# EAGLE design circle_9axis (EAGLE 7.4.0)
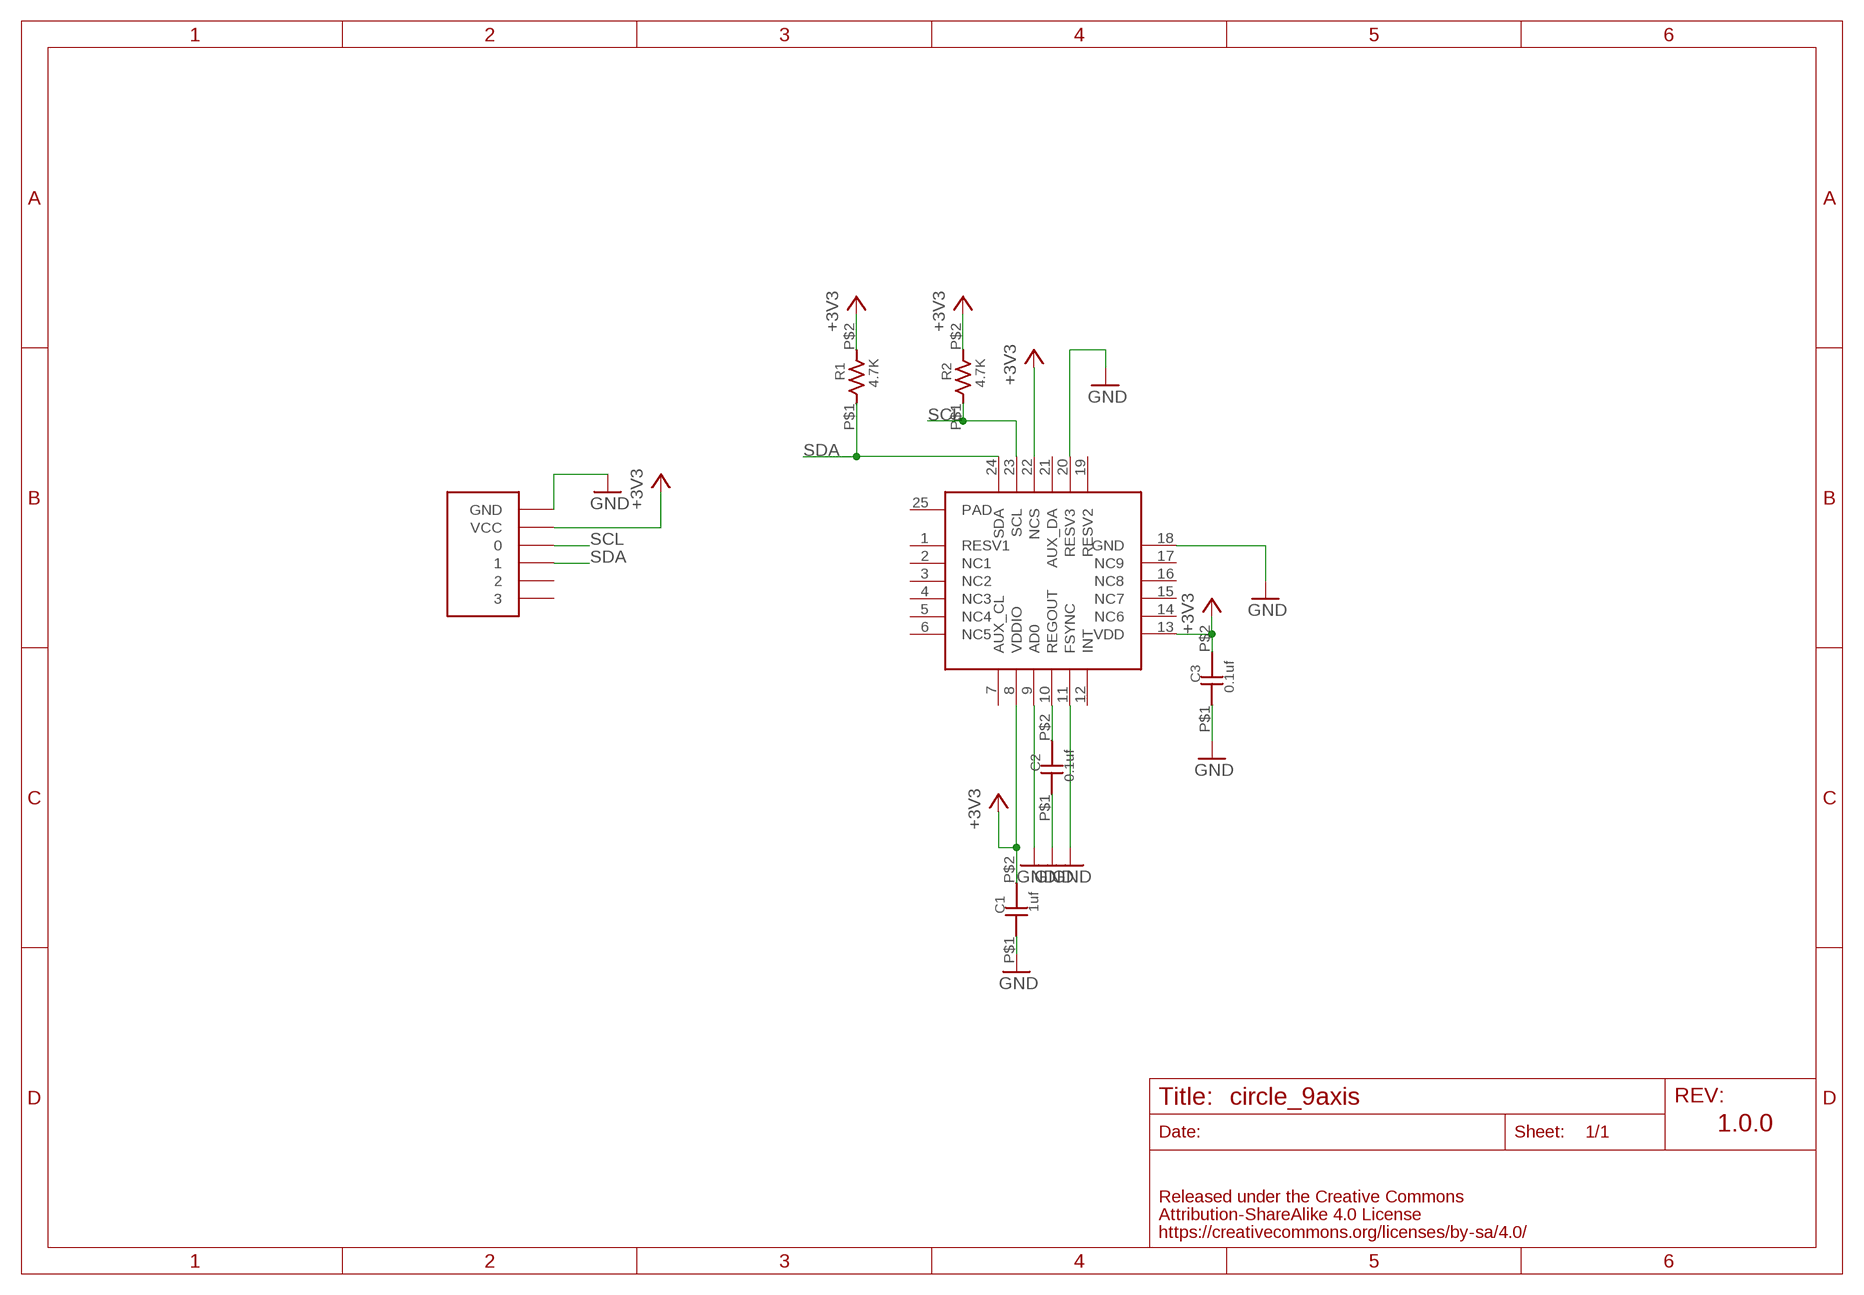
[diagram p0: schematic, sheet 1]

## Parts
C1  1uf  0402  [0402]
C2  0.1uf  0402  [0402]
C3  0.1uf  0402  [0402]
R1  4.7K  0402  [0402]
R2  4.7K  0402  [0402]
U$1  INVENSENSE-MPU9250  [LGA-24]
U$4  FABO-NANO  [FABO-NANO]

## Nets
+3V3: C1.P$2 C3.P$2 R1.P$2 R2.P$2 U$1.8(VDDIO) U$1.13(VDD) U$1.22(NCS) U$4.VCC
GND: C1.P$1 C2.P$1 C3.P$1 U$1.9(AD0) U$1.11(FSYNC) U$1.18(GND) U$1.20(RESV3) U$4.GND
N$3: C2.P$2 U$1.10(REGOUT)
SCL: R2.P$1 U$1.23(SCL) U$4.0
SDA: R1.P$1 U$1.24(SDA) U$4.1
Unconnected: U$1.1(RESV1) U$1.2(NC1) U$1.3(NC2) U$1.4(NC3) U$1.5(NC4) U$1.6(NC5) U$1.7(AUX_CL) U$1.12(INT) U$1.14(NC6) U$1.15(NC7) U$1.16(NC8) U$1.17(NC9) U$1.19(RESV2) U$1.21(AUX_DA) U$1.25(PAD) U$4.2 U$4.3

## Notes on the sheet
- 1.0.0

## Library data of the parts
C1-C3 = FaBo-Capacitor:0402: CAPACITOR 0402
R1 R2 = FaBo-Resistors:0402
U$1 = GClue-Mems:INVENSENSE-MPU9250
U$4 = FaBo-Template:FABO-NANO

## Board
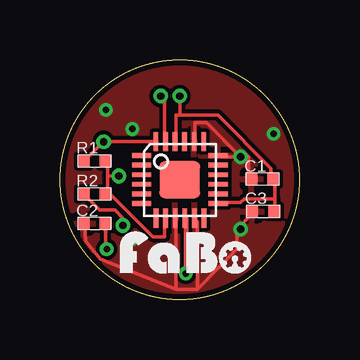
[diagram p1: board, top side]
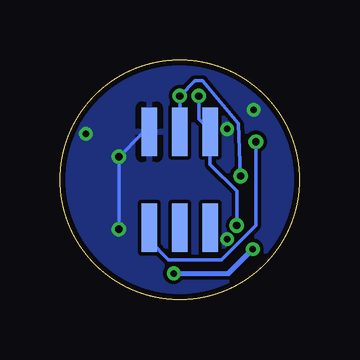
[diagram p2: board, bottom side, seen from below]

Size 10 x 10 mm. Coordinates in mm from the lower left corner, seen from the top.
Copper layers (1*16): Top 0.035mm / dielectric 1.5mm / Bottom 0.035mm
Design rules "SeeedStudio_2layer_DRU_no_angle_20140221": minimum track width 6mil, minimum drill 12mil, track to track 6mil, track to pad 6mil, pad to pad 6mil, via to via 6mil, smd to smd 0mil, copper to edge 10mil, drill to drill 10mil, minimum pad ring 10mil, minimum via ring 6mil, stop-mask expansion 2mil, vias tented up to drill 100mil, thermal gap 10mil

### Footprints (pad centres in the part's own frame; a part is rotated, then mirrored left to right if it is on the bottom)
0402 = smd 0.5 x 0.5: P$1 -0.46,0; P$2 0.46,0
LGA-24 = smd 0.8 x 0.2: 1 -1.6,1.01; 2 -1.6,0.61; 3 -1.6,0.21; 4 -1.6,-0.19; 5 -1.6,-0.59; 6 -1.6,-0.99; 13 1.6,-0.99; 14 1.6,-0.59; 15 1.6,-0.19; 16 1.6,0.21; 17 1.6,0.61; 18 1.6,1.01 | smd 0.2 x 0.8: 7 -0.99,-1.6; 8 -0.59,-1.6; 9 -0.19,-1.6; 10 0.21,-1.6; 11 0.61,-1.6; 12 1.01,-1.6; 19 1,1.6; 20 0.6,1.6; 21 0.2,1.6; 22 -0.2,1.6; 23 -0.6,1.6; 24 -1,1.6 | smd 1.7 x 1.55: 25 0,0
FABO-NANO = smd 0.635 x 2.032 bottom: 0 -1.27,2; 1 1.27,-2; 2 0,-2; 3 -1.27,-2; GND 1.27,2; VCC 0,2

### Placement (x,y rotation side)
C1  8.45,5.03 0 top
C2  1.44,3.17 0 top
C3  8.48,3.68 0 top
R1  1.44,5.79 0 top
R2  1.44,4.42 0 top
U$1  5,5 0 top
U$3  [LOGO_FABO_S]  5.3,1.09 0 top
U$4  5,5 0 top

### Tracks (layer width: path | path; a pad name or v marks a point on that pad's centre or on a via)
+3V3  (via drill 0.3)
  Top 0.152: 1.98,5.16 1.98,5.63 R1.P$2 | 1.98,5.16 1.98,4.52 R2.P$2 1.98,4.37 2.14,4.37 3.89,2.62 4.37,2.62 4.37,3.25 U$1.8 | 8.97,4.21 8.97,3.73 C3.P$2 | 8.97,4.21 8.97,5 C1.P$2 8.81,5.16 8.81,5.48 6.59,7.7 5,7.7 | 5,7.7 4.84,7.7 4.84,6.75 U$1.22 | 8.97,4.21 7.7,4.21 7.54,4.05 6.75,4.05 U$1.13 | 5,7.7 v5,8.49 | v2.46,5.16 1.98,5.16
  Bottom 0.152: U$4.VCC v5,8.49 4.37,9.13 4.05,9.13 2.56,7.34 v2.46,5.16
GND  (via drill 0.27, 0.3)
  Top 0.152: v7.54,5.95 6.75,5.95 U$1.18 | v7.54,5.95 7.86,5.95 7.86,5.16 C1.P$1 | v7.54,5.95 6.11,7.38 5.63,7.38 5.63,6.75 U$1.20 | 4.84,0.43 1.68,1.69 1.06,2.45 1.03,3.09 C2.P$1 | 4.84,0.43 4.84,3.25 U$1.9 | 7.38,2.94 7.39,2.11 5.74,0.43 | 7.38,2.94 8.02,3.57 C3.P$1 | 4.84,0.43 5.74,0.43 | 5.74,0.43 5.74,3.25 U$1.11 | 7.38,2.94 v7.54,2.94
  Bottom 0.152: U$4.GND 6.27,6.91 6.59,6.91 v7.54,5.95 v7.54,2.94
  other vias: 1.92,7.92 8.92,6.92 3.02,7.12 3.02,2.52
  pour Bottom: -0.08,-0.08 9.92,-0.08 9.92,9.92 -0.08,9.92
  pour Top: -0.08,-0.08 9.92,-0.08 9.92,9.92 -0.08,9.92
N$3  (via drill 0.27)
  Top 0.152: C2.P$2 1.9,3.12 1.9,2.21 v1.95,2.1
  Top 0.203: U$1.10 5.25,3.4 v5.25,1.09
  Bottom 0.203: v5.25,1.09 2.97,1.09 v1.95,2.1
SCL  (via drill 0.3)
  Top 0.152: v2.62,3.09 2.62,3.41 2.3,3.73 1.67,3.73 1.03,4.37 R2.P$1 | v4.21,8.49 4.37,8.49 4.37,6.75 U$1.23
  Bottom 0.152: v2.62,3.09 2.62,4.52 3.73,5.63 U$4.0 3.73,7.06 4.21,7.54 v4.21,8.49
SDA  (via drill 0.3)
  Top 0.152: R1.P$1 1.03,5.79 v1.82,6.59 4.05,6.59 U$1.24
  Bottom 0.152: v1.82,6.59 1.82,3.09 3.25,1.67 5.48,1.67 6.27,2.46 U$4.1